# EAGLE design batt_rev_1 (EAGLE 6.3)
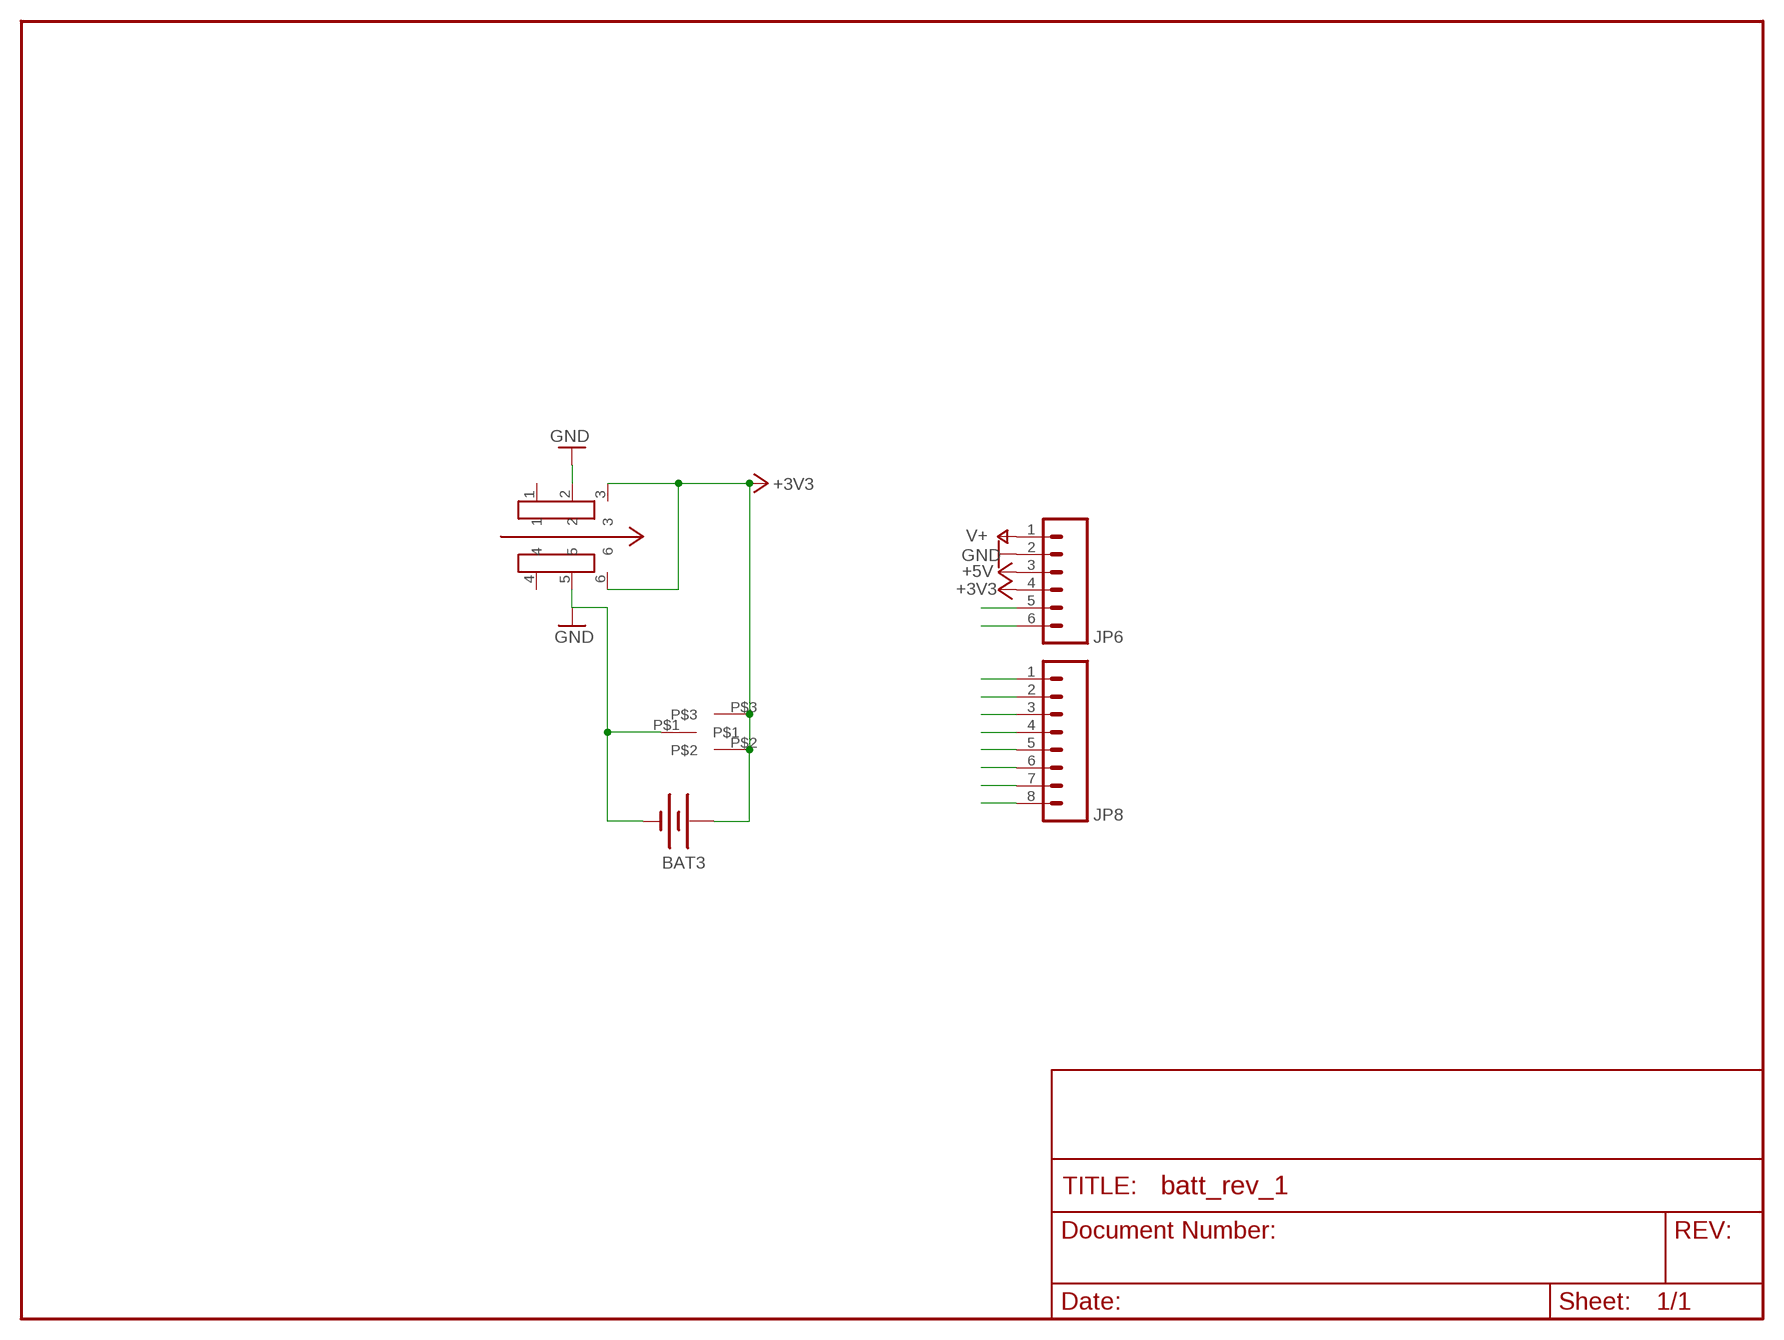
[diagram p0: schematic, sheet 1]

## Parts
BAT3  BATTERY20PTH  [BATTCOM_20MM_PTH]
JP6  6  M06SIP  [1X06]
JP8  8  M081X08  [1X08]
U$1  SWITCH  [SWITCH]
U$2  BATT_2032  [BATT_2032]

## Nets
+3V3: BAT3.1(+) JP6.4 U$1.3 U$1.6 U$2.P$2 U$2.P$3
+5V: JP6.3
AREF_D0: JP8.8
D1: JP8.7
D2: JP8.6
D3: JP8.5
D5: JP8.3
D7: JP8.1
D8: JP6.5
D9: JP6.6
GND: BAT3.2(-) JP6.2 U$1.2 U$1.5 U$2.P$1
SCL_D4: JP8.4
SDA_D6: JP8.2
V+: JP6.1
Unconnected: U$1.1 U$1.4

## Library data of the parts
BAT3 = SparkFun_mod:BATTERY: Battery Holders Various common sizes : AA, AAA, 20mm coin cell and 12mm coin cell.
JP6 = SparkFun:M06: Header 6 Standard 6-pin 0.1" header. Use with straight break away headers (SKU : PRT-00116), right angle break away headers (PRT-00553), swiss pins (PRT-00743), machine pins (PRT-00117), and female headers (PRT-00115). Molex polarized connector foot print use with SKU : PRT-08094 with associated crimp pins and housings. NOTES ON THE VARIANTS LOCK and LOCK_LONGPADS... This footprint was designed to help hold the alignment of a through-hole component (i.e. 6-pin header) while soldering it into place. You may notice that each hole has been shifted either up or down by 0.005 of an inch from it's more standard position (which is a perfectly straight line). This slight alteration caused the pins (the squares in the middle) to touch the edges of the holes. Because they are alternating, it causes a "brace" to hold the component in place. 0.005 has proven to be the perfect amount of "off-center" position when using our standard breakaway headers. Although looks a little odd when you look at the bare footprint, once you have a header in there, the alteration is very hard to notice. Also, if you push a header all the way into place, it is covered up entirely on the bottom side. This idea of altering the position of holes to aid alignment will be further integrated into the Sparkfun Library for other footprints. It can help hold any component with 3 or more connection pins.
JP8 = SparkFun:M08: Header 8 Standard 8-pin 0.1" header. Use with straight break away headers (SKU : PRT-00116), right angle break away headers (PRT-00553), swiss pins (PRT-00743), machine pins (PRT-00117), and female headers (PRT-00115).
U$1 = _my-parts:SWITCH: JS202011AQN DPDT
U$2 = _my-parts:BATT_2032

## Board
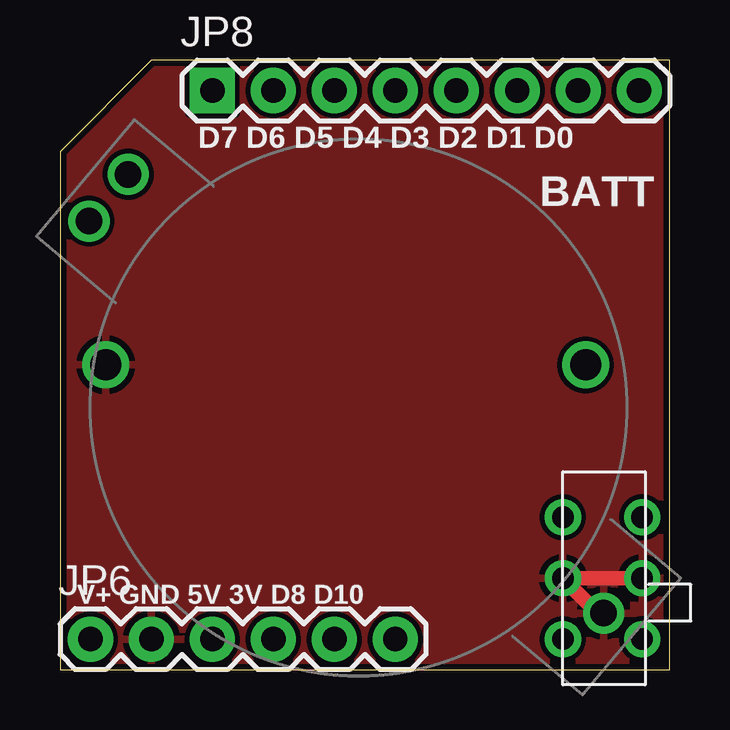
[diagram p1: board, top side]
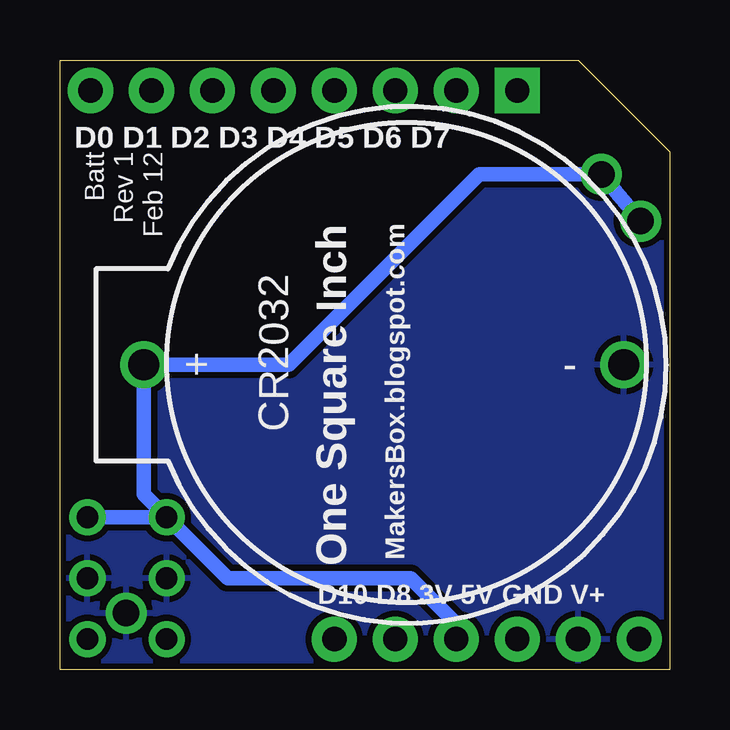
[diagram p2: board, bottom side, seen from below]

Size 25.4 x 25.4 mm. Coordinates in mm from the lower left corner, seen from the top.
Outline: 25.4,25.4 25.4,21.59 25.4,0 24.77,0 24.77,0 0,0 0,21.59
Outline: 25.4,25.4 3.81,25.4 0,21.59
Outline: 0,21.59 0,21.59
Copper layers (1*16): Top 0.035mm / dielectric 1.5mm / Bottom 0.035mm
Design rules "SparkFun": minimum track width 8mil, minimum drill 20mil, track to track 8mil, track to pad 8mil, pad to pad 8mil, via to via 8mil, smd to smd 8mil, copper to edge 10mil, drill to drill 8mil, minimum pad ring 12mil, minimum via ring 10mil, stop-mask expansion 4mil, vias tented up to drill 25mil, thermal gap 10mil

### Footprints (pad centres in the part's own frame; a part is rotated, then mirrored left to right if it is on the bottom)
BATTCOM_20MM_PTH = drill 1.3: 1 20,0; 2 0,0
1X06 = drill 1.016 pad 1.88: 1 0,0; 2 2.54,0; 3 5.08,0; 4 7.62,0; 5 10.16,0; 6 12.7,0
1X08 = drill 1.016 pad 1.88 square: 1 0,0 | drill 1.016 pad 1.88: 2 2.54,0; 3 5.08,0; 4 7.62,0; 5 10.16,0; 6 12.7,0; 7 15.24,0; 8 17.78,0
SWITCH = drill 0.9: 1 -2.54,2.54; 2 0,2.54; 3 2.54,2.54; 4 -2.54,-0.762; 5 0,-0.762; 6 2.54,-0.762
BATT_2032 = drill 1.1: P$1 13.716,0; P$2 -13.208,1.27; P$3 -13.208,-1.27

### Placement (x,y rotation side)
BAT3  1.91,12.7 0 top
JP6  1.27,1.27 0 top
JP8  6.35,24.13 0 top
U$1  23.5,3.81 90 top
U$2  12.14,11.18 320 top

### Tracks (layer width: path | path; a pad name or v marks a point on that pad's centre or on a via)
+3V3
  Bottom 0.61: U$2.P$3 U$2.P$2 7.94,20.64 15.88,12.7 BAT3.1 21.91,7.3 U$1.3 | U$1.3 U$1.6 | JP6.4 8.89,1.91 10.79,3.81 18.41,3.81 U$1.3
GND
  Top 0.61: U$1.5 U$1.2 22.41,2.36 U$2.P$1
  pour Bottom (isolate 0.254): -1.27,26.67 26.67,26.67 26.67,-1.27 -1.27,-1.27
  pour Top: -0.64,26.04 26.67,26.04 26.67,0 26.04,-0.64 -0.64,-0.64

### Text on the board
tPlace: D7 D6 D5 D4 D3 D2 D1 D0 | BATT | V+ GND 5V 3V D8 D10
bPlace: Batt / Rev 1 / Feb 12 | D0 D1 D2 D3 D4 D5 D6 D7 | MakersBox.blogspot.com | One Square Inch | D10 D8 3V 5V GND V+